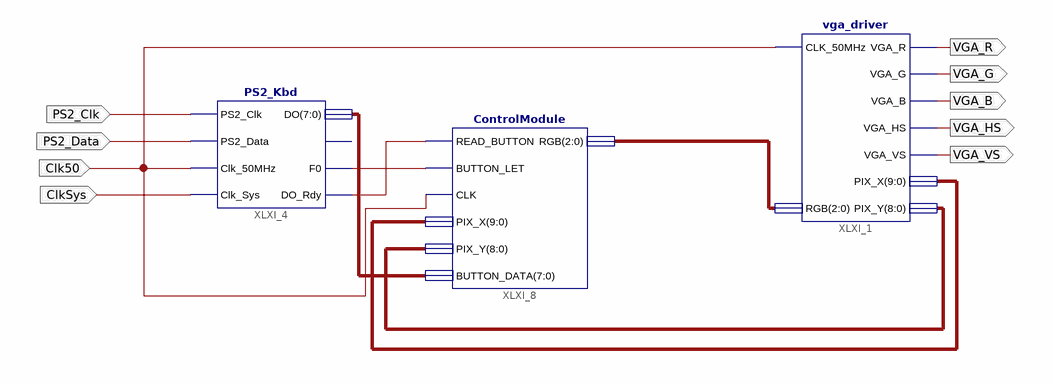
[diagram p0: schematic sheet 1]
// Xilinx ISE schematic vga_sch.sch (aspartan6) as structural Verilog: 3 symbols, 9 ports
module vga_sch (
  input  ClkSys,
  input  PS2_Clk,
  input  PS2_Data,
  input  Clk50,
  output VGA_R,
  output VGA_G,
  output VGA_B,
  output VGA_HS,
  output VGA_VS
);

  wire XLXN_24, XLXN_25;
  wire [2:0] XLXN_8;
  wire [7:0] XLXN_23;
  wire [8:0] XLXN_9;
  wire [9:0] XLXN_10;

  vga_driver XLXI_1 (
    .CLK_50MHz(Clk50), .RGB(XLXN_8), .VGA_R(VGA_R), .VGA_G(VGA_G), .VGA_B(VGA_B), .VGA_HS(VGA_HS),
    .VGA_VS(VGA_VS), .PIX_X(XLXN_10), .PIX_Y(XLXN_9));
  PS2_Kbd XLXI_4 (
    .PS2_Clk(PS2_Clk), .PS2_Data(PS2_Data), .Clk_50MHz(Clk50), .F0(XLXN_25), .DO_Rdy(XLXN_24), .DO(XLXN_23),
    .Clk_Sys(ClkSys));  // open: E0
  ControlModule XLXI_8 (
    .READ_BUTTON(XLXN_24), .BUTTON_LET(XLXN_25), .CLK(Clk50), .PIX_X(XLXN_10), .PIX_Y(XLXN_9),
    .BUTTON_DATA(XLXN_23), .RGB(XLXN_8));
endmodule
